# Altium schematic sheet LVDS_IFC_DAC.SchDoc: LVDS & I2C
size 420 x 297 mm; Author: G.K.; CompanyName: WUT; DrawnBy: G.K.; Organization: WUT ISE; Address1: Warsaw Univeristy of Technology; Address2: Nowowiejska 15/19; DocumentNumber: 2; SheetNumber: 2; SheetTotal: 6; EDA_Number: ARTIQ; Projet: Zotino; ModifiedBy: -; CreateDate: XX/XX/XXXX; CheckedDate: -; Title2: interfaces; DivGrp: ISE; Designer: G.K.; ModifiedDate: -; ProjectName: 32 CHANNEL 16bit DAC
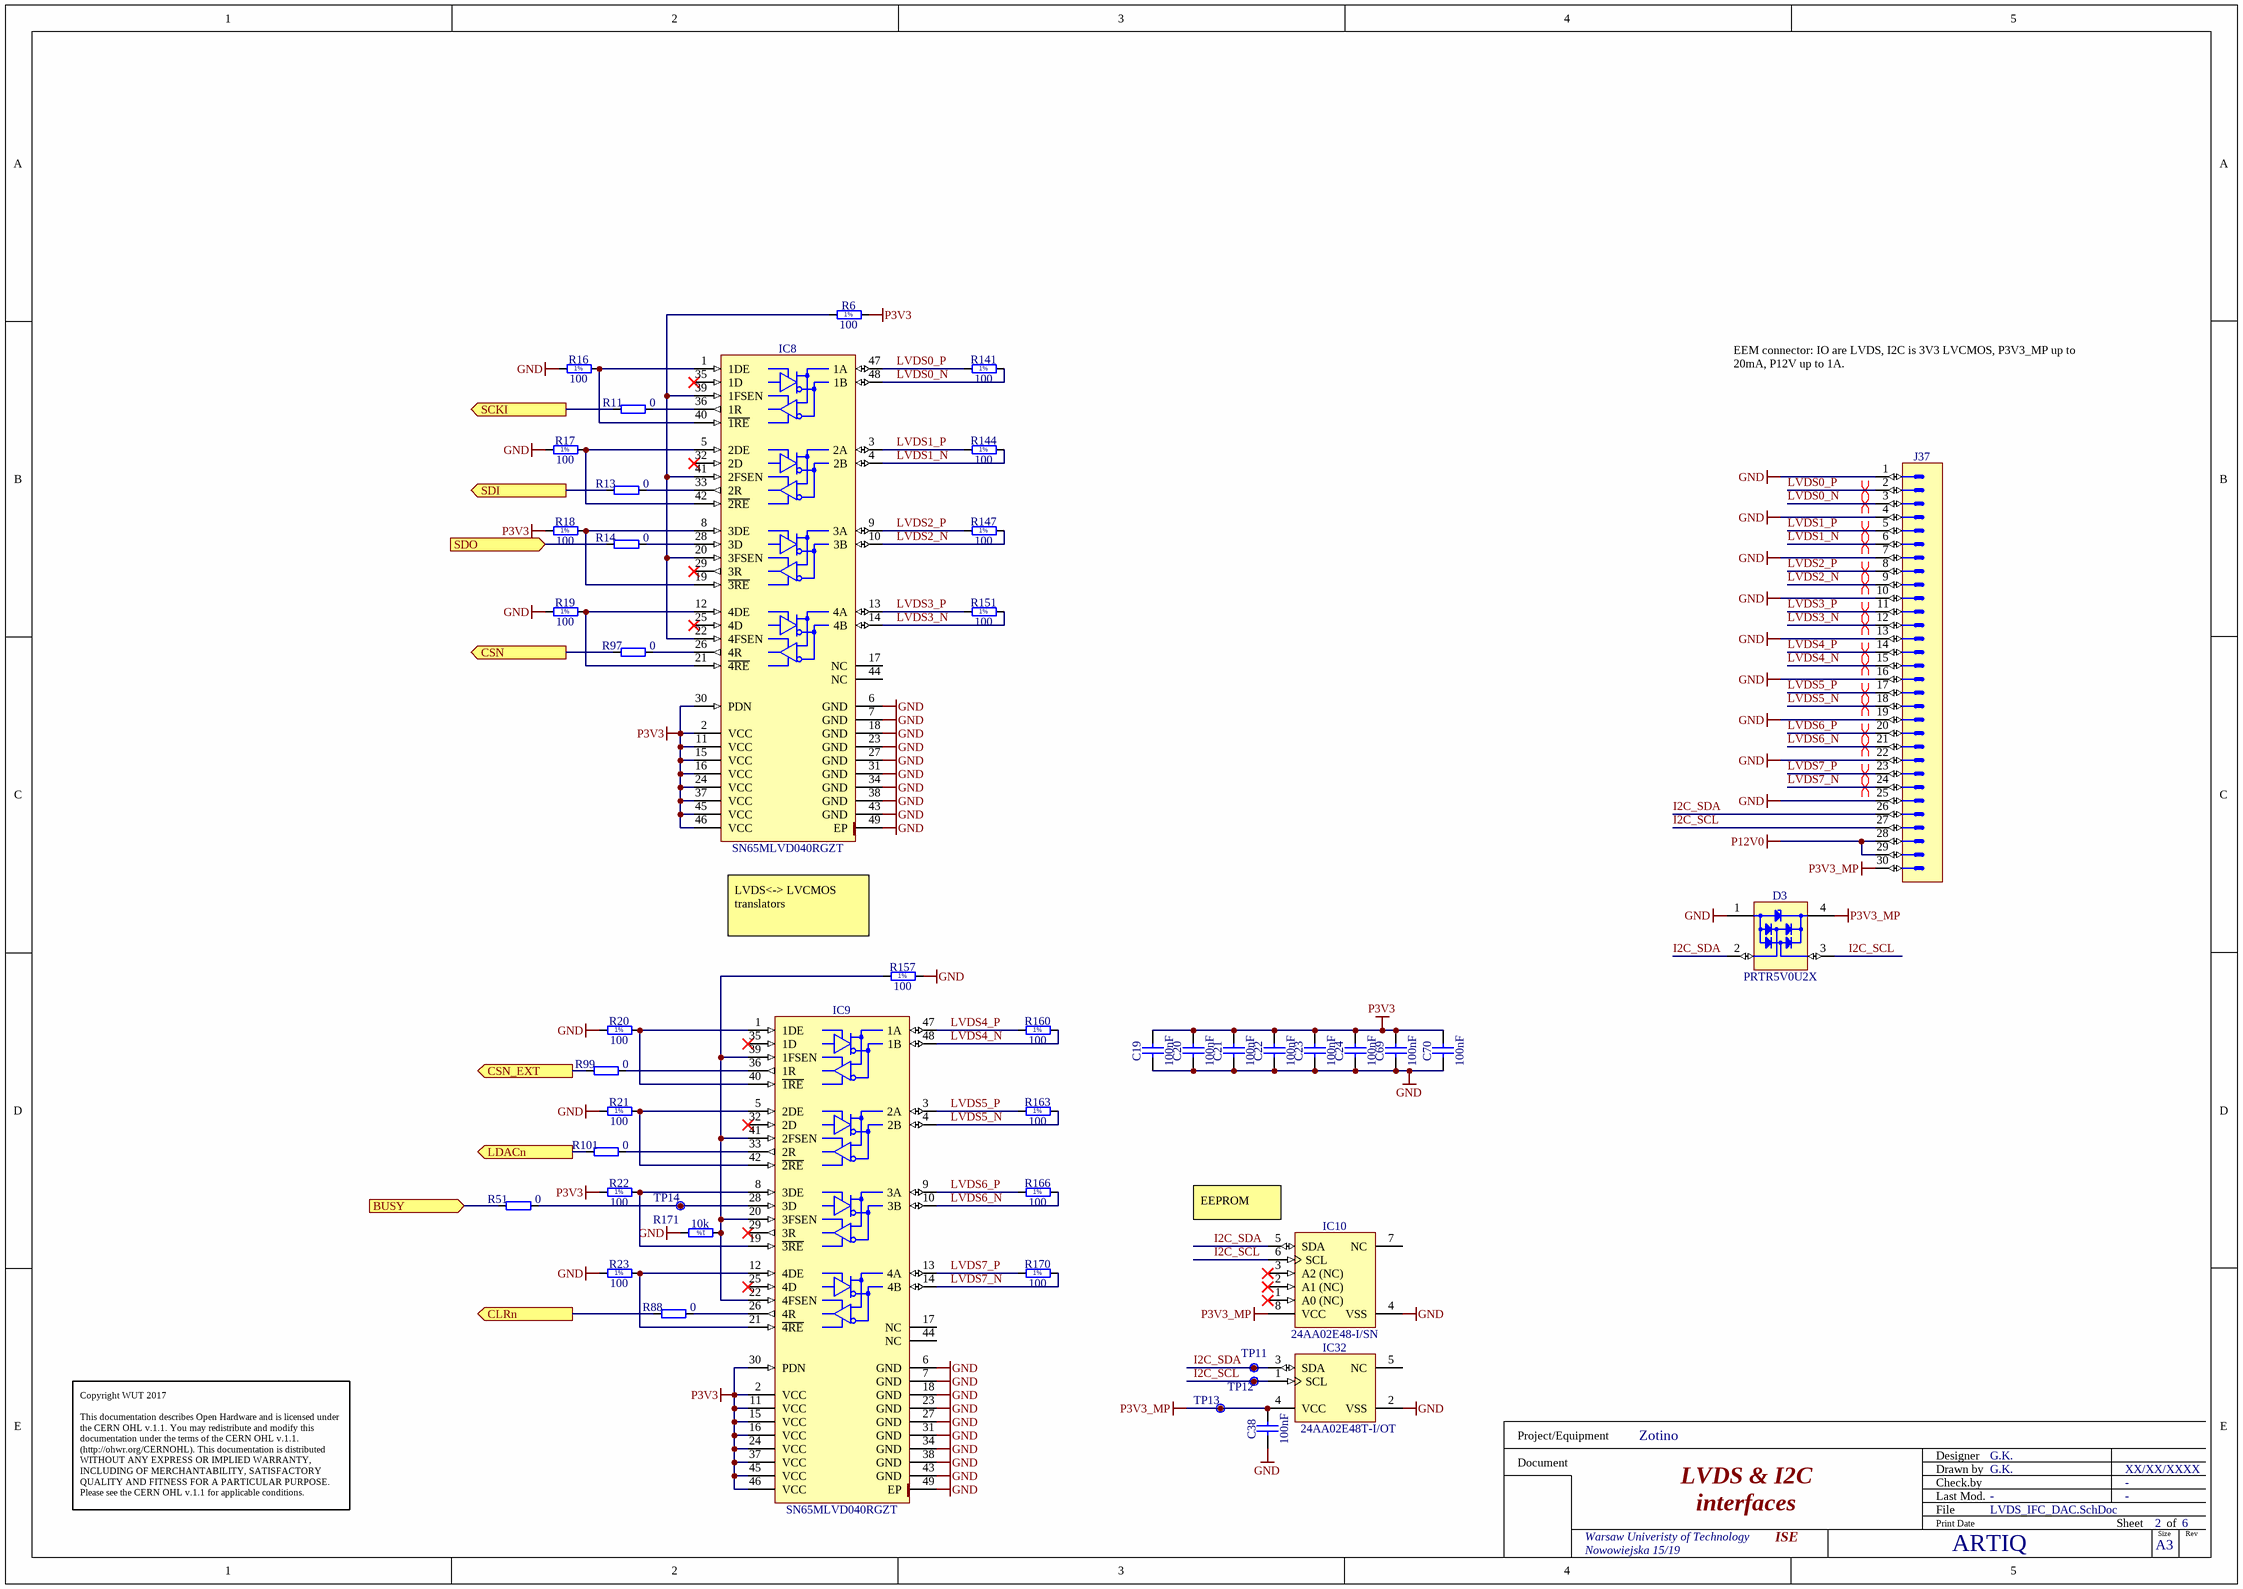
[diagram p0: LVDS_IFC_DAC.SchDoc]

## Parts
C19  100nF  [CAPC1005X55N]
C20  100nF  [CAPC1005X55N]
C21  100nF  [CAPC1005X55N]
C22  100nF  [CAPC1005X55N]
C23  100nF  [CAPC1005X55N]
C24  100nF  [CAPC1005X55N]
C38  100nF  [CAPC1005X55N]
C69  100nF  [CAPC1005X55N]
C70  100nF  [CAPC1005X55N]
D3  PRTR5V0U2X  [SOT190P230X110-4N]
IC8  SN65MLVD040RGZT  [QFN50P700X700X100-49N-S420]
IC9  SN65MLVD040RGZT  [QFN50P700X700X100-49N-S420]
IC10  24AA02E48-I/SN  [SOIC127P600X175-8N]
IC32  24AA02E48T-I/OT  [SOT95P280X145-5N]
J37  (no value)  [3M_N2530-6002RB]
R6  100  [RESC1005X40N]
R11  0  [RESC1005X40N]
R13  0  [RESC1005X40N]
R14  0  [RESC1005X40N]
R16  100  [RESC1005X40N]
R17  100  [RESC1005X40N]
R18  100  [RESC1005X40N]
R19  100  [RESC1005X40N]
R20  100  [RESC1005X40N]
R21  100  [RESC1005X40N]
R22  100  [RESC1005X40N]
R23  100  [RESC1005X40N]
R51  0  [RESC1005X40N]
R88  0  [RESC1005X40N]
R97  0  [RESC1005X40N]
R99  0  [RESC1005X40N]
R101  0  [RESC1005X40N]
R141  100  [RESC1005X40N]
R144  100  [RESC1005X40N]
R147  100  [RESC1005X40N]
R151  100  [RESC1005X40N]
R157  100  [RESC1005X40N]
R160  100  [RESC1005X40N]
R163  100  [RESC1005X40N]
R166  100  [RESC1005X40N]
R170  100  [RESC1005X40N]
R171  10k  [RESC1005X40N]
TP11  Test Point  [TPS127]  (value not drawn)  (no BOM)
TP12  Test Point  [TPS127]  (value not drawn)  (no BOM)
TP13  Test Point  [TPS127]  (value not drawn)  (no BOM)
TP14  Test Point  [TPS127]  (value not drawn)  (no BOM)

## Ports
BUSY (in), CLRn (out), CSN (out), CSN_EXT (out), LDACn (out), SCKI (out), SDI (out), SDO (in)

## Nets
GND: C19.1 C20.1 C21.1 C22.1 C23.1 C24.1 C38.1 C69.1 C70.1 D3.1(GND) IC8.6(GND) IC8.7(GND) IC8.18(GND) IC8.23(GND) IC8.27(GND) IC8.31(GND) IC8.34(GND) IC8.38(GND) IC8.43(GND) IC8.49(EP) IC9.6(GND) IC9.7(GND) IC9.18(GND) IC9.23(GND) IC9.27(GND) IC9.31(GND) IC9.34(GND) IC9.38(GND) IC9.43(GND) IC9.49(EP) IC10.4(VSS) IC32.2(VSS) J37.1 J37.4 J37.7 J37.10 J37.13 J37.16 J37.19 J37.22 J37.25 R16.1 R17.1 R19.1 R20.1 R21.1 R23.1 R157.2 R171.2
P3V3: C19.2 C20.2 C21.2 C22.2 C23.2 C24.2 C69.2 C70.2 IC8.2(VCC) IC8.11(VCC) IC8.15(VCC) IC8.16(VCC) IC8.24(VCC) IC8.30(PDN) IC8.37(VCC) IC8.45(VCC) IC8.46(VCC) IC9.2(VCC) IC9.11(VCC) IC9.15(VCC) IC9.16(VCC) IC9.24(VCC) IC9.30(PDN) IC9.37(VCC) IC9.45(VCC) IC9.46(VCC) R6.2 R18.1 R22.1
P3V3_MP: C38.2 D3.4(VCC) IC10.8(VCC) IC32.4(VCC) J37.30 TP13.1
P12V0: J37.28 J37.29
BUSY: R51.1 ; port BUSY
CLRn: R88.1 ; port CLRn
CSN: R97.1 ; port CSN
CSN_EXT: R99.1 ; port CSN_EXT
I2C_SCL: D3.3(I/O2) IC10.6(SCL) IC32.1(SCL) J37.27 TP12.1
I2C_SDA: D3.2(I/O1) IC10.5(SDA) IC32.3(SDA) J37.26 TP11.1
LDACn: R101.1 ; port LDACn
LVDS0_N: IC8.48(1B) J37.3 R141.2
LVDS0_P: IC8.47(1A) J37.2 R141.1
LVDS1_N: IC8.4(2B) J37.6 R144.2
LVDS1_P: IC8.3(2A) J37.5 R144.1
LVDS2_N: IC8.10(3B) J37.9 R147.2
LVDS2_P: IC8.9(3A) J37.8 R147.1
LVDS3_N: IC8.14(4B) J37.12 R151.2
LVDS3_P: IC8.13(4A) J37.11 R151.1
LVDS4_N: IC9.48(1B) J37.15 R160.2
LVDS4_P: IC9.47(1A) J37.14 R160.1
LVDS5_N: IC9.4(2B) J37.18 R163.2
LVDS5_P: IC9.3(2A) J37.17 R163.1
LVDS6_N: IC9.10(3B) J37.21 R166.2
LVDS6_P: IC9.9(3A) J37.20 R166.1
LVDS7_N: IC9.14(4B) J37.24 R170.2
LVDS7_P: IC9.13(4A) J37.23 R170.1
SCKI: R11.1 ; port SCKI
SDI: R13.1 ; port SDI
SDO: R14.1 ; port SDO
NetIC8_1: IC8.1(1DE) IC8.40(~{1RE}) R16.2
NetIC8_5: IC8.5(2DE) IC8.42(~{2RE}) R17.2
NetIC8_8: IC8.8(3DE) IC8.19(~{3RE}) R18.2
NetIC8_12: IC8.12(4DE) IC8.21(~{4RE}) R19.2
NetIC8_20: IC8.20(3FSEN) IC8.22(4FSEN) IC8.39(1FSEN) IC8.41(2FSEN) R6.1
NetIC8_26: IC8.26(4R) R97.2
NetIC8_28: IC8.28(3D) R14.2
NetIC8_33: IC8.33(2R) R13.2
NetIC8_36: IC8.36(1R) R11.2
NetIC9_1: IC9.1(1DE) IC9.40(~{1RE}) R20.2
NetIC9_5: IC9.5(2DE) IC9.42(~{2RE}) R21.2
NetIC9_8: IC9.8(3DE) IC9.19(~{3RE}) R22.2
NetIC9_12: IC9.12(4DE) IC9.21(~{4RE}) R23.2
NetIC9_20: IC9.20(3FSEN) IC9.22(4FSEN) IC9.39(1FSEN) IC9.41(2FSEN) R157.1 R171.1
NetIC9_26: IC9.26(4R) R88.2
NetIC9_28: IC9.28(3D) R51.2 TP14.1
NetIC9_33: IC9.33(2R) R101.2
NetIC9_36: IC9.36(1R) R99.2

Not connected (* = marked no-connect by the designer): IC8 17(NC) 25(4D)* 29(3R)* 32(2D)* 35(1D)* 44(NC); IC9 17(NC) 25(4D)* 29(3R)* 32(2D)* 35(1D)* 44(NC); IC10 1(A0_(NC))* 2(A1_(NC))* 3(A2_(NC))* 7(NC); IC32 5(NC)

## Layout directives
differential pair: LVDS0_N, LVDS0_P, LVDS1_N, LVDS1_P, LVDS2_N, LVDS2_P, LVDS3_N, LVDS3_P, LVDS4_N, LVDS4_P, LVDS5_N, LVDS5_P, LVDS6_N, LVDS6_P, LVDS7_N, LVDS7_P

## Notes on the sheet
- EEM connector: IO are LVDS, I2C is 3V3 LVCMOS, P3V3_MP up to 20mA, P12V up to 1A.
- LVDS<-> LVCMOS translators
- (near IC10) EEPROM
- Copyright WUT 2017
  This documentation describes Open Hardware and is licensed under the CERN OHL v.1.1. You may redistribute and modify this documentation under the terms of the CERN OHL v.1.1. (http://ohwr.org/CERNOHL). This documentation is distributed WITHOUT ANY EXPRESS OR IMPLIED WARRANTY, INCLUDING OF MERCHANTABILITY, SATISFACTORY QUALITY AND FITNESS FOR A PARTICULAR PURPOSE. Please see the CERN OHL v.1.1 for applicable conditions.
- Project/Equipment
- Document
- Designer
- Drawn by
- Check.by
- File
- Last Mod.
- Print Date
- Sheet
- Size
- A3
- of
- Rev
- (in symbol R0402_10K_1%_0.0625W_100PPM) 1%
- (in symbol R0402_100R_1%_0.1W_100PPM) 1%

## Library data of the parts
C19-C24 C38 C69 C70 = CC0402_100NF_16V_10%_X5R: Non-polarised capacitor; Part Description: SMD Multilayer Chip Ceramic Capacitor; Manufacturer: GENERIC; Manufacturer1 Part Number: GRM155R61C104KA88D; Voltage: 16V; TC: X5R; Tolerance: ±10%; Part Number: CC0402_100NF_16V_10%_X5R; Component Kind: Standard; Component Type: Standard; Pin Count: 2; Value: 100nF; Status: None; Manufacturer Part Number: CC0402_100NF_16V_10%_X5R; Case: 0402; Mounted: Yes; Socket: No; SMD: Yes; Sense: No; Manufacturer1 Example: MURATA; Manufacturer1 ComponentHeight: 0.55mm; HelpURL: \\cern.ch\dfs\Applications\Altium\Datasheets\CC0402_X5R_MURATA_GRM.pdf; Author: CERN DEM JLC; CreateDate: 10.12.2013; LatestRevisionDate: 10.12.2013
D3 = PRTR5V0U2X: Ultra Low Capacitance Double Rail-to-Rail ESD Protection Diode; Part Description: Ultra Low Capacitance (1pF) Double Rail-to-Rail ESD Protection Diode (8kV); Manufacturer: NXP SEMICONDUCTORS; Voltage: 5.5V; PressFit: No; Bonding: No; Part Number: PRTR5V0U2X; Component Kind: Standard; Component Type: Standard; Device: PRTR5V0U2X; PackageDescription: SOT143B, SOT, 1.90mm Pitch; 4 Pin, 1.30mm W X 2.90mm L X 1.10mm H body, IPC Medium Density; Manufacturer Part Number: PRTR5V0U2X; Pin Count: 4; Case: SOT143B; Mounted: Yes; Socket: No; SMD: Yes; Sense: No; ComponentHeight: 1.1mm; HelpURL: \\cern.ch\dfs\Applications\Altium\Datasheets\PRTR5V0U2X.pdf; Author: CERN DEM JLC; CreateDate: 22.03.2011; LatestRevisionDate: 22.03.2011
IC8 IC9 = SN65MLVD040RGZT: 4-Channel Half-Duplex M-LVDS Line Transceiver; Manufacturer: TEXAS INSTRUMENTS; PressFit: No; Bonding: No; Part Number: SN65MLVD040RGZT; Component Kind: Standard; Component Type: Standard; Device: SN65MLVD040RGZT; PackageDescription: QFN, 0.50mm Pitch, Square; 48 Pin, 7.00mm L X 7.00mm W X 1mm H body (W/Thermal Tab 4.2mm X 4.2mm), IPC Medium Density; Part Description: 4-Channel Half-Duplex M-LVDS Line Transceiver; Manufacturer Part Number: SN65MLVD040RGZT; Pin Count: 49; Case: QFN48; Mounted: Yes; Socket: No; SMD: Yes; Sense: No; ComponentHeight: 1mm; Author: CERN DEM JLC; HelpURL: \\cern.ch\dfs\Applications\Altium\Datasheets\SN65MLVD040RGZT.pdf; CreateDate: 17.03.2011; LatestRevisionDate: 17.03.2011
IC10 = 24AA02E48-I/SN: 1.7V-5.5V, 2K I2C™ Serial EEPROMs with EUI-48™ Node Identity; Manufacturer: MICROCHIP TECHNOLOGY; PressFit: No; Bonding: No; Part Number: 24AA02E48-I/SN; Component Kind: Standard; Component Type: Standard; Device: 24AA02E48-I/SN; PackageDescription: SOIC, 1.27mm Pitch; 8 Pin - Body 4x5mm, IPC Medium Density; Part Description: 1.7V-5.5V, 2K I2C™ Serial EEPROMs with EUI-48™ Node Identity; Manufacturer Part Number: 24AA02E48-I/SN; Pin Count: 8; Case: SOIC8; Mounted: Yes; Socket: No; SMD: Yes; Sense: No; ComponentHeight: 1.75mm; HelpURL: \\cern.ch\dfs\Applications\Altium\Datasheets\24AA025E48-I-SN.pdf; Author: CERN DEM MR; CreateDate: 19.07.2016; LatestRevisionDate: 19.07.2016
IC32 = 24AA02E48T-I/OT: 1.7V-5.5V, 2K I2C Serial EEPROM With EUI-48 Node Identity; Manufacturer: MICROCHIP TECHNOLOGY; PressFit: No; Bonding: No; Part Number: 24AA02E48T-I/OT; Component Kind: Standard; Component Type: Standard; Device: 24AA02E48T-I/OT; PackageDescription: SOT, 0.95mm pitch; 5 pin, 1.60mm W X 2.90mm L X 1.45mm H body, IPC Medium Density; Part Description: 1.7V-5.5V, 2K I2C Serial EEPROM With EUI-48 Node Identity; Manufacturer Part Number: 24AA02E48T-I/OT; Pin Count: 5; Case: SOT23-5; Mounted: Yes; Socket: No; SMD: Yes; Sense: No; ComponentHeight: 1.45mm; HelpURL: \\cern.ch\dfs\Applications\Altium\Datasheets\24AA02E48T-I-OT.pdf; Author: CERN DEM MR; CreateDate: 31.03.2016; LatestRevisionDate: 31.03.2016
J37 = 3M_N2530-6002RB: Connector 30 Male; Part Description: 30 Contacts - Straight .100'' x .100'' Low Profile Four-Wall Header, 2500 Series; Manufacturer: 3M; PressFit: No; Part Number: 3M_N2530-6002RB; Component Kind: Standard; Component Type: Standard; Pin Count: 30; Family: Header 30; Mounted: Yes; Socket: No; SMD: No; Sense: No; Status: None; Manufacturer Part Number: N2530-6002RB; ComponentHeight: 10.03mm; HelpURL: \\cern.ch\dfs\Applications\Altium\Datasheets\3M_N2530-6002RB.pdf; Author: CERN DEM JLC; CreateDate: 11.02.2009; LatestRevisionDate: 11.08.2009
R6 R16-R23 R141 R144 R147 R151 R157 R160 R163 R166 R170 = R0402_100R_1%_0.1W_100PPM: Resistor - 1%; Part Description: General Purpose Thick Film Chip Resistor; Manufacturer: GENERIC; Manufacturer Part Number: R0402_100R_1%_0.1W_100PPM_50V; Manufacturer1 Part Number: ERJ2RKF1000X; Power: 0.1W; TC: ±100ppm/°C; Voltage: 50V; Part Number: R0402_100R_1%_0.1W_100PPM; Component Kind: Standard; Component Type: Standard; Pin Count: 2; Value: 100; Status: Not recommended; Tolerance: ±1%; Case: 0402; Mounted: Yes; Sense: No; Socket: No; SMD: Yes; Manufacturer1 Example: PANASONIC; Manufacturer1 ComponentHeight: 0.4mm; HelpURL: \\cern.ch\dfs\Applications\Altium\Datasheets\R0402_PANASONIC_ERJ2RK.pdf; Author: CERN DEM JLC; CreateDate: 12.12.2013; LatestRevisionDate: 03.03.2015
R11 R13 R14 R51 R88 R97 R99 R101 = R0402_0R_JUMPER: Resistor; Part Description: 1A (0.05R Max DC Resistance) Zero Ohm Jumper; Manufacturer: GENERIC; Manufacturer1 Part Number: 232270591001L; Part Number: R0402_0R_JUMPER; Component Kind: Standard; Component Type: Standard; Pin Count: 2; Value: 0; Status: Not recommended; Manufacturer Part Number: R0402_0R_JUMPER; Case: 0402; Mounted: Yes; Sense: No; Socket: No; SMD: Yes; Manufacturer1 Example: YAGEO PHYCOMP; Manufacturer1 ComponentHeight: 0.4mm; HelpURL: \\cern.ch\dfs\Applications\Altium\Datasheets\R0402_Phycomp_RC0402.pdf; Author: CERN DEM JLC; CreateDate: 03.12.2007; LatestRevisionDate: 17.10.2012
R171 = R0402_10K_1%_0.0625W_100PPM: Resistor - 1%; Part Description: General Purpose Thick Film Chip Resistor; Manufacturer: GENERIC; Manufacturer1 Part Number: 232270671003L; TC: ±100ppm/°C; Part Number: R0402_10K_1%_0.0625W_100PPM; Component Kind: Standard; Component Type: Standard; Pin Count: 2; Value: 10k; Status: Not recommended; Power: 0.0625W; Tolerance: ±1%; Manufacturer Part Number: R0402_10K_1%_0.0625W_100PPM; Case: 0402; Mounted: Yes; Sense: No; Socket: No; SMD: Yes; Manufacturer1 Example: YAGEO PHYCOMP; Manufacturer1 ComponentHeight: 0.4mm; HelpURL: \\cern.ch\dfs\Applications\Altium\Datasheets\R0402_Phycomp_RC0402.pdf; Author: CERN DEM JLC; CreateDate: 03.12.2007; LatestRevisionDate: 17.10.2012
TP11-TP14 = SMD_PAD_1.27X1.27MM: Part Description: 1.27mm x 1.27mm PCB Copper Area (SMD Test Point); Mounted: No; Part Number: SMD_PAD_1.27X1.27MM; Component Type: Standard (No BOM); Pin Count: 1; Family: Test Point; Socket: No; SMD: Yes; Sense: No; Status: None; ComponentHeight: 0mm; HelpURL: Undefined; Author: CERN DEM JLC; CreateDate: 12.01.2008; LatestRevisionDate: 12.01.2008; PackageDescription: 1.27mm x 1.27mm PCB Copper Area (SMD Test Point)